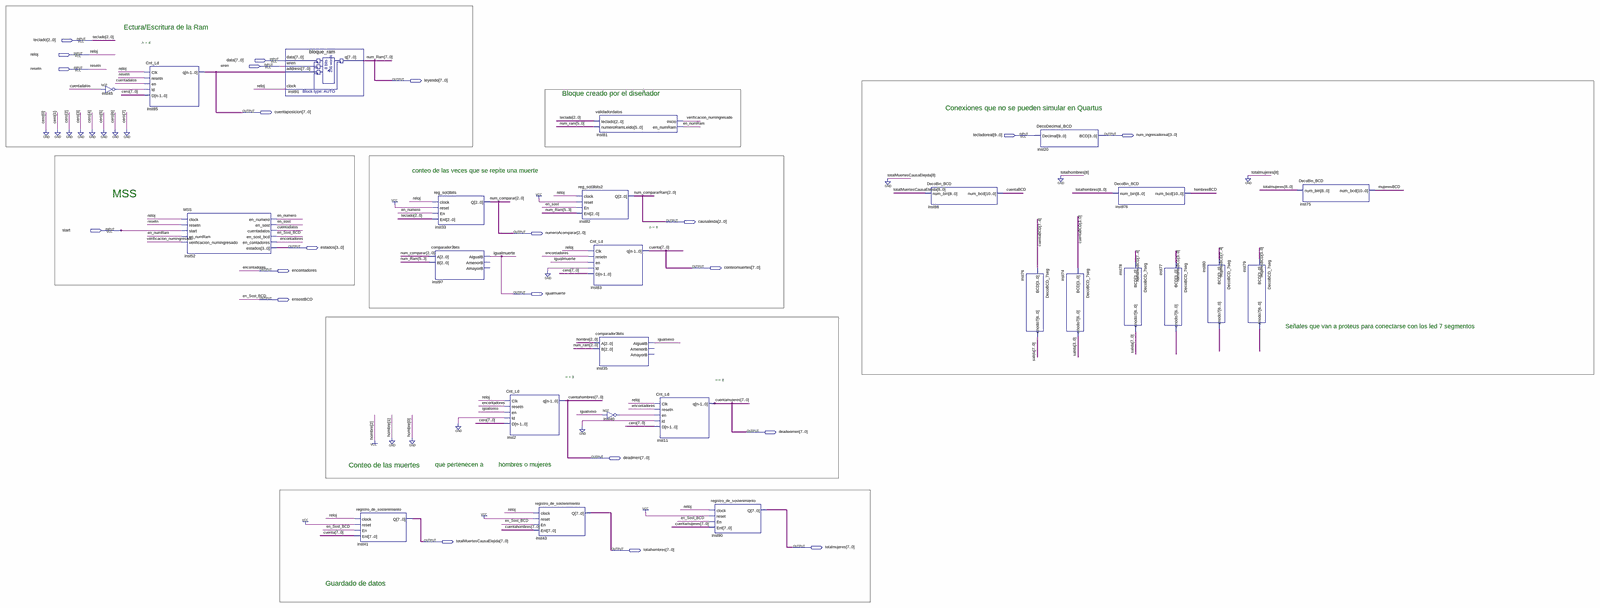
[diagram p0: schematic sheet, whole]
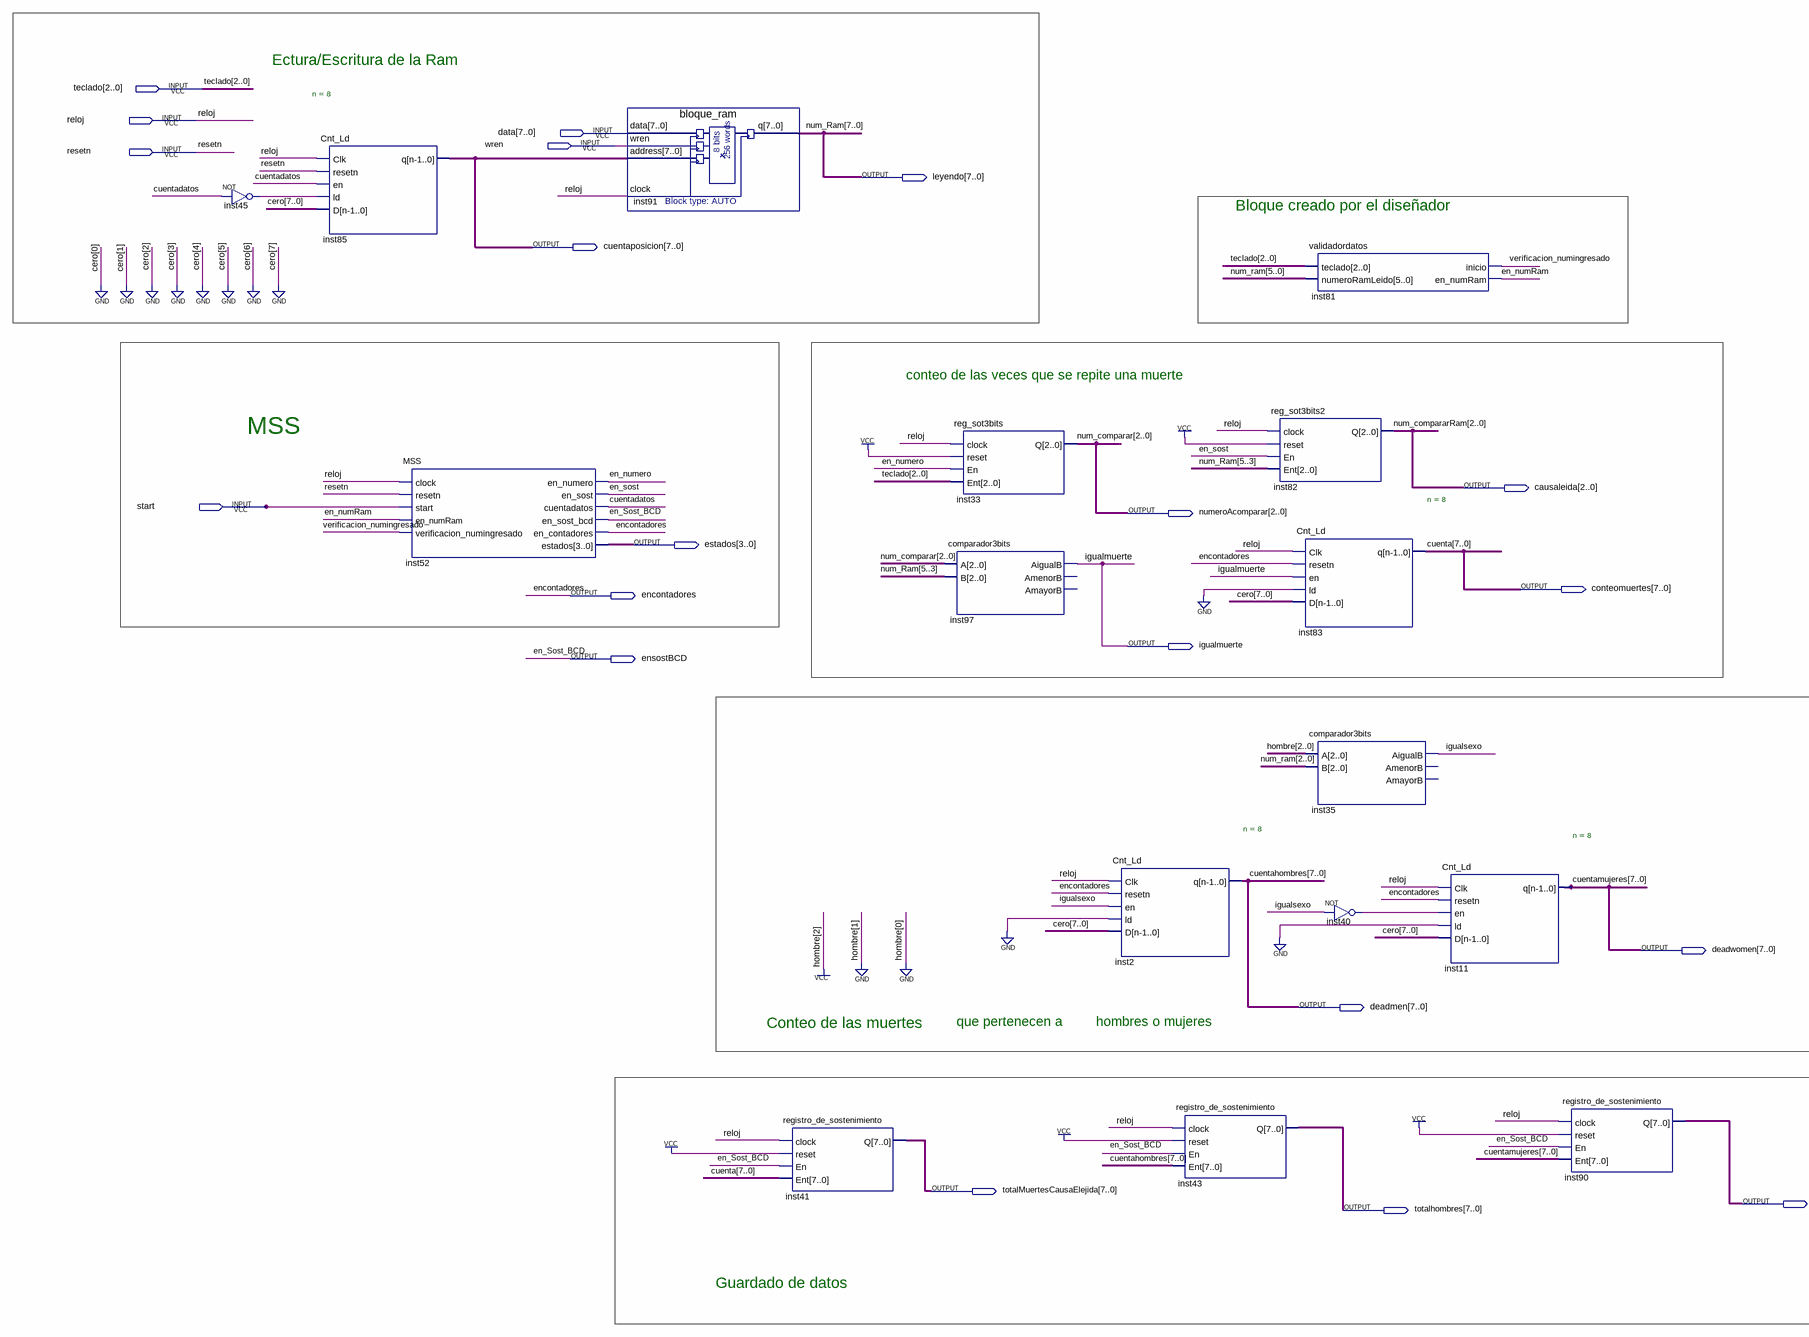
[diagram p1: schematic sheet, left part]
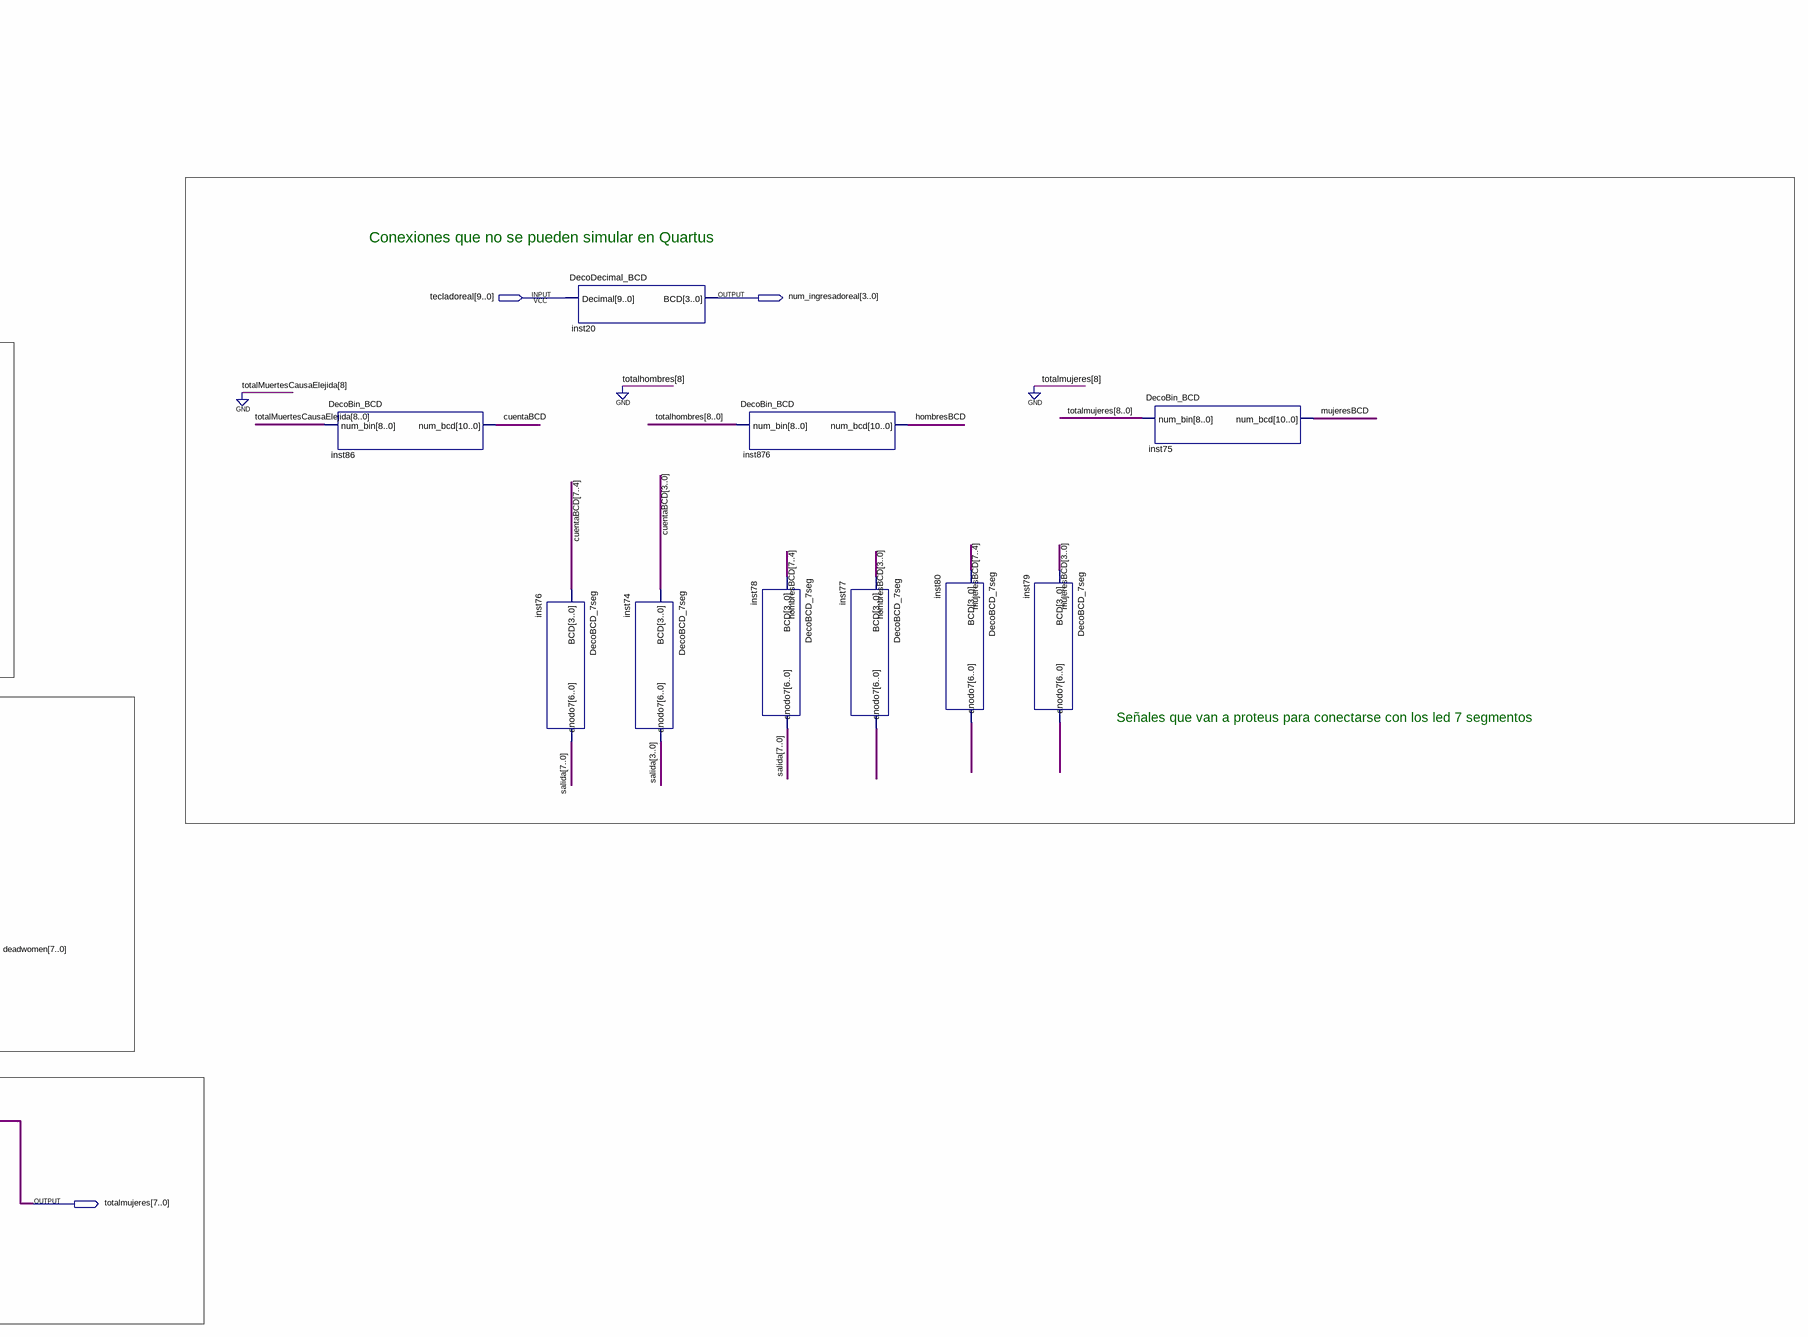
[diagram p2: schematic sheet, right part]
// Quartus schematic diagrama.bdf as structural Verilog: 26 symbols, 22 pins
module diagrama (
  input  [2:0] teclado,
  input  reloj,
  input  [7:0] data,
  input  wren,
  input  resetn,
  input  [9:0] tecladoreal,
  input  start,
  output [7:0] leyendo,
  output [7:0] cuentaposicion,
  output [3:0] num_ingresadoreal,
  output [2:0] causaleida,
  output [2:0] numeroAcomparar,
  output [3:0] estados,
  output [7:0] conteomuertes,
  output encontadores,
  output igualmuerte,
  output ensostBCD,
  output [7:0] deadwomen,
  output [7:0] deadmen,
  output [7:0] totalMuertesCausaElejida,
  output [7:0] totalmujeres,
  output [7:0] totalhombres
);

  wire cuentaBCD_1bit, cuentadatos, en_numero, en_numRam, en_sost, hombresBCD_1bit, igualsexo, inst40_out,
       inst45_out, mujeresBCD_1bit, verificacion_numingresado;
  wire [6:0] inst77_anodo7, inst79_anodo7, inst80_anodo7;
  wire [7:0] cuentaBCD, hombresBCD, mujeresBCD, salida;

  not inst45 (inst45_out, cuentadatos);
  Cnt_Ld #(.n(8)) inst85 (
    .Clk(reloj), .resetn(resetn), .en(cuentadatos), .ld(inst45_out), .D({8{1'b0}}), .q(cuentaposicion));
  MSS inst52 (
    .clock(reloj), .resetn(resetn), .start(start), .en_numRam(en_numRam),
    .verificacion_numingresado(verificacion_numingresado), .en_numero(en_numero), .en_sost(en_sost),
    .cuentadatos(cuentadatos), .en_sost_bcd(ensostBCD), .en_contadores(encontadores), .estados(estados));
  bloque_ram inst91 (.data(data), .wren(wren), .address(cuentaposicion), .clock(reloj), .q(leyendo));
  registro_de_sostenimiento inst41 (
    .clock(reloj), .reset(1'b1), .En(ensostBCD), .Ent(conteomuertes), .Q(totalMuertesCausaElejida));
  reg_sot3bits inst33 (.clock(reloj), .reset(1'b1), .En(en_numero), .Ent(teclado), .Q(numeroAcomparar));
  comparador3bits inst97 (.A(numeroAcomparar), .B(leyendo[5:3]), .AigualB(igualmuerte));  // open: AmenorB, AmayorB
  Cnt_Ld #(.n(8)) inst2 (.Clk(reloj), .resetn(encontadores), .en(igualsexo), .ld(1'b0), .D({8{1'b0}}), .q(deadmen));
  registro_de_sostenimiento inst43 (.clock(reloj), .reset(1'b1), .En(ensostBCD), .Ent(deadmen), .Q(totalhombres));
  reg_sot3bits2 inst82 (.clock(reloj), .reset(1'b1), .En(en_sost), .Ent(leyendo[5:3]), .Q(causaleida));
  validadordatos inst81 (
    .teclado(teclado), .numeroRamLeido(leyendo[5:0]), .inicio(verificacion_numingresado),
    .en_numRam(en_numRam));
  Cnt_Ld #(.n(8)) inst83 (
    .Clk(reloj), .resetn(encontadores), .en(igualmuerte), .ld(1'b0), .D({8{1'b0}}), .q(conteomuertes));
  comparador3bits inst35 (.A(3'b100), .B(leyendo[2:0]), .AigualB(igualsexo));  // open: AmenorB, AmayorB
  not inst40 (inst40_out, igualsexo);
  Cnt_Ld #(.n(8)) inst11 (.Clk(reloj), .resetn(encontadores), .en(inst40_out), .ld(1'b0), .D({8{1'b0}}), .q(deadwomen));
  registro_de_sostenimiento inst90 (.clock(reloj), .reset(1'b1), .En(ensostBCD), .Ent(deadwomen), .Q(totalmujeres));
  DecoBin_BCD inst86 (.num_bin({1'b0, totalMuertesCausaElejida}), .num_bcd(cuentaBCD_1bit));
  DecoDecimal_BCD inst20 (.Decimal(tecladoreal), .BCD(num_ingresadoreal));
  DecoBCD_7seg inst76 (.BCD(cuentaBCD[7:4]), .anodo7(salida));
  DecoBCD_7seg inst74 (.BCD(cuentaBCD[3:0]), .anodo7(salida[3:0]));
  DecoBin_BCD inst876 (.num_bin({1'b0, totalhombres}), .num_bcd(hombresBCD_1bit));
  DecoBCD_7seg inst78 (.BCD(hombresBCD[7:4]), .anodo7(salida));
  DecoBCD_7seg inst77 (.BCD(hombresBCD[3:0]), .anodo7(inst77_anodo7));
  DecoBCD_7seg inst80 (.BCD(mujeresBCD[7:4]), .anodo7(inst80_anodo7));
  DecoBCD_7seg inst79 (.BCD(mujeresBCD[3:0]), .anodo7(inst79_anodo7));
  DecoBin_BCD inst75 (.num_bin({1'b0, totalmujeres}), .num_bcd(mujeresBCD_1bit));

  // Other names for the same wires on the sheet: num_compararRam[2:0] = causaleida; cuenta[7:0] = conteomuertes;
  //   cuentahombres[7:0] = deadmen; cuentamujeres[7:0] = deadwomen; en_Sost_BCD = ensostBCD; num_Ram[7:0] = leyendo;
  //   num_comparar[2:0] = numeroAcomparar

  // Notes on the sheet:
  //   Ectura/Escritura de la Ram
  //   Bloque creado por el diseñador
  //   Conexiones que no se pueden simular en Quartus
  //   conteo de las veces que se repite una muerte
  //   MSS
  //   Señales que van a proteus para conectarse con los led 7 segmentos
  //   Conteo de las muertes 
  //   que pertenecen a 
  //   hombres o mujeres
  //   Guardado de datos
endmodule
